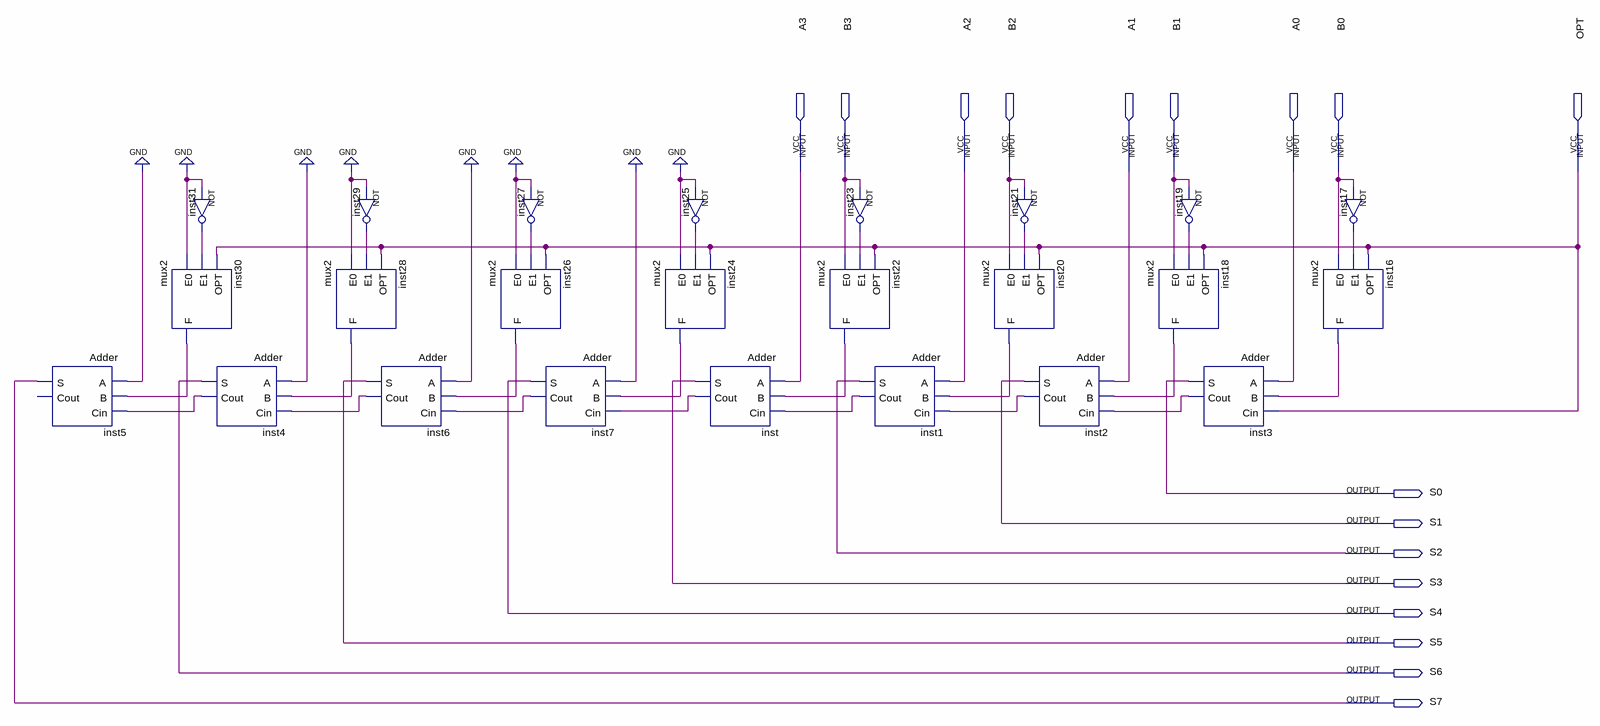
[diagram p0: schematic sheet]
// Quartus schematic 4Bit_Adder-Subtractor.bdf as structural Verilog: 24 symbols, 17 pins
module \4Bit_Adder-Subtractor  (
  input  A3,
  input  B3,
  input  A2,
  input  B2,
  input  A1,
  input  B1,
  input  A0,
  input  B0,
  input  OPT,
  output S0,
  output S1,
  output S2,
  output S3,
  output S4,
  output S5,
  output S6,
  output S7
);

  wire inst1_cout, inst2_cout, inst3_cout, inst4_cout, inst6_cout, inst7_cout, inst16_f, inst17_out,
       inst18_f, inst19_out, inst20_f, inst21_out, inst22_f, inst23_out, inst24_f, inst25_out, inst26_f,
       inst27_out, inst28_f, inst29_out, inst30_f, inst31_out, inst_cout;

  Adder inst5 (.A(1'b0), .B(inst30_f), .Cin(inst4_cout), .S(S7));  // open: Cout
  not inst31 (inst31_out, 1'b0);
  mux2 inst30 (.E0(1'b0), .E1(inst31_out), .OPT(OPT), .F(inst30_f));
  Adder inst4 (.A(1'b0), .B(inst28_f), .Cin(inst6_cout), .S(S6), .Cout(inst4_cout));
  mux2 inst28 (.E0(1'b0), .E1(inst29_out), .OPT(OPT), .F(inst28_f));
  not inst29 (inst29_out, 1'b0);
  Adder inst6 (.A(1'b0), .B(inst26_f), .Cin(inst7_cout), .S(S5), .Cout(inst6_cout));
  mux2 inst26 (.E0(1'b0), .E1(inst27_out), .OPT(OPT), .F(inst26_f));
  not inst27 (inst27_out, 1'b0);
  Adder inst7 (.A(1'b0), .B(inst24_f), .Cin(inst_cout), .S(S4), .Cout(inst7_cout));
  not inst25 (inst25_out, 1'b0);
  mux2 inst24 (.E0(1'b0), .E1(inst25_out), .OPT(OPT), .F(inst24_f));
  Adder inst (.A(A3), .B(inst22_f), .Cin(inst1_cout), .S(S3), .Cout(inst_cout));
  not inst23 (inst23_out, B3);
  mux2 inst22 (.E0(B3), .E1(inst23_out), .OPT(OPT), .F(inst22_f));
  Adder inst1 (.A(A2), .B(inst20_f), .Cin(inst2_cout), .S(S2), .Cout(inst1_cout));
  mux2 inst20 (.E0(B2), .E1(inst21_out), .OPT(OPT), .F(inst20_f));
  not inst21 (inst21_out, B2);
  Adder inst2 (.A(A1), .B(inst18_f), .Cin(inst3_cout), .S(S1), .Cout(inst2_cout));
  mux2 inst18 (.E0(B1), .E1(inst19_out), .OPT(OPT), .F(inst18_f));
  not inst19 (inst19_out, B1);
  Adder inst3 (.A(A0), .B(inst16_f), .Cin(OPT), .S(S0), .Cout(inst3_cout));
  not inst17 (inst17_out, B0);
  mux2 inst16 (.E0(B0), .E1(inst17_out), .OPT(OPT), .F(inst16_f));
endmodule
